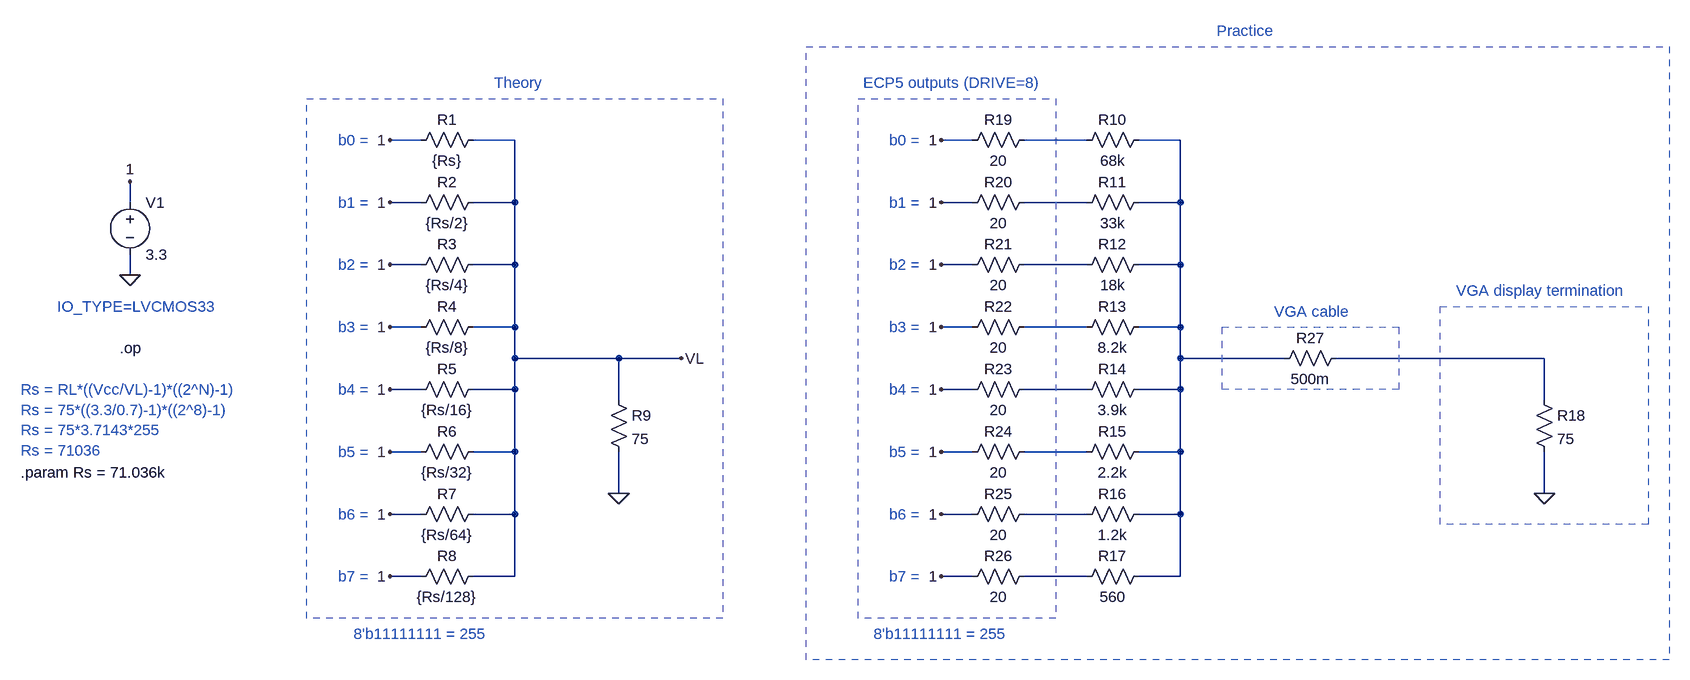
[diagram p0: schematic scon2019_badge_vga_ltspice.asc]
scon2019_badge_vga_ltspice.asc, the LTspice schematic file:
Version 4
SHEET 1 2388 804
WIRE 416 -80 368 -80
WIRE 560 -80 496 -80
WIRE 1264 -80 1216 -80
WIRE 1440 -80 1344 -80
WIRE 1584 -80 1520 -80
WIRE -32 16 -32 -16
WIRE 416 16 368 16
WIRE 560 16 560 -80
WIRE 560 16 496 16
WIRE 1264 16 1216 16
WIRE 1440 16 1344 16
WIRE 1584 16 1584 -80
WIRE 1584 16 1520 16
WIRE 416 112 368 112
WIRE 560 112 560 16
WIRE 560 112 496 112
WIRE 1264 112 1216 112
WIRE 1440 112 1344 112
WIRE 1584 112 1584 16
WIRE 1584 112 1520 112
WIRE -32 128 -32 96
WIRE 416 208 368 208
WIRE 560 208 560 112
WIRE 560 208 496 208
WIRE 1264 208 1216 208
WIRE 1440 208 1344 208
WIRE 1584 208 1584 112
WIRE 1584 208 1520 208
WIRE 560 256 560 208
WIRE 720 256 560 256
WIRE 816 256 720 256
WIRE 1584 256 1584 208
WIRE 1744 256 1584 256
WIRE 2144 256 1824 256
WIRE 416 304 368 304
WIRE 560 304 560 256
WIRE 560 304 496 304
WIRE 1264 304 1216 304
WIRE 1440 304 1344 304
WIRE 1584 304 1584 256
WIRE 1584 304 1520 304
WIRE 720 320 720 256
WIRE 2144 320 2144 256
WIRE 416 400 368 400
WIRE 560 400 560 304
WIRE 560 400 496 400
WIRE 1264 400 1216 400
WIRE 1440 400 1344 400
WIRE 1584 400 1584 304
WIRE 1584 400 1520 400
WIRE 720 464 720 400
WIRE 2144 464 2144 400
WIRE 416 496 368 496
WIRE 560 496 560 400
WIRE 560 496 496 496
WIRE 1264 496 1216 496
WIRE 1440 496 1344 496
WIRE 1584 496 1584 400
WIRE 1584 496 1520 496
WIRE 416 592 368 592
WIRE 560 592 560 496
WIRE 560 592 496 592
WIRE 1264 592 1216 592
WIRE 1440 592 1344 592
WIRE 1584 592 1584 496
WIRE 1584 592 1520 592
FLAG -32 128 0
FLAG -32 -16 1
FLAG 368 -80 1
FLAG 368 16 1
FLAG 368 112 1
FLAG 368 208 1
FLAG 368 304 1
FLAG 368 400 1
FLAG 368 496 1
FLAG 368 592 1
FLAG 720 464 0
FLAG 816 256 VL
FLAG 1216 -80 1
FLAG 1216 16 1
FLAG 1216 112 1
FLAG 1216 208 1
FLAG 1216 304 1
FLAG 1216 400 1
FLAG 1216 496 1
FLAG 1216 592 1
FLAG 2144 464 0
DATAFLAG 720 256 ""
DATAFLAG 2144 256 ""
SYMBOL voltage -32 0 R0
WINDOW 123 0 0 Left 0
WINDOW 39 0 0 Left 0
SYMATTR InstName V1
SYMATTR Value 3.3
SYMBOL res 512 -96 R90
WINDOW 0 0 56 VBottom 2
WINDOW 3 32 56 VTop 2
SYMATTR InstName R1
SYMATTR Value {Rs}
SYMBOL res 512 0 R90
WINDOW 0 0 56 VBottom 2
WINDOW 3 32 56 VTop 2
SYMATTR InstName R2
SYMATTR Value {Rs/2}
SYMBOL res 512 96 R90
WINDOW 0 0 56 VBottom 2
WINDOW 3 32 56 VTop 2
SYMATTR InstName R3
SYMATTR Value {Rs/4}
SYMBOL res 512 192 R90
WINDOW 0 0 56 VBottom 2
WINDOW 3 32 56 VTop 2
SYMATTR InstName R4
SYMATTR Value {Rs/8}
SYMBOL res 512 288 R90
WINDOW 0 0 56 VBottom 2
WINDOW 3 32 56 VTop 2
SYMATTR InstName R5
SYMATTR Value {Rs/16}
SYMBOL res 512 384 R90
WINDOW 0 0 56 VBottom 2
WINDOW 3 32 56 VTop 2
SYMATTR InstName R6
SYMATTR Value {Rs/32}
SYMBOL res 512 480 R90
WINDOW 0 0 56 VBottom 2
WINDOW 3 32 56 VTop 2
SYMATTR InstName R7
SYMATTR Value {Rs/64}
SYMBOL res 512 576 R90
WINDOW 0 0 56 VBottom 2
WINDOW 3 32 56 VTop 2
SYMATTR InstName R8
SYMATTR Value {Rs/128}
SYMBOL res 704 304 R0
SYMATTR InstName R9
SYMATTR Value 75
SYMBOL res 1536 -96 R90
WINDOW 0 0 56 VBottom 2
WINDOW 3 32 56 VTop 2
SYMATTR InstName R10
SYMATTR Value 68k
SYMBOL res 1536 0 R90
WINDOW 0 0 56 VBottom 2
WINDOW 3 32 56 VTop 2
SYMATTR InstName R11
SYMATTR Value 33k
SYMBOL res 1536 96 R90
WINDOW 0 0 56 VBottom 2
WINDOW 3 32 56 VTop 2
SYMATTR InstName R12
SYMATTR Value 18k
SYMBOL res 1536 192 R90
WINDOW 0 0 56 VBottom 2
WINDOW 3 32 56 VTop 2
SYMATTR InstName R13
SYMATTR Value 8.2k
SYMBOL res 1536 288 R90
WINDOW 0 0 56 VBottom 2
WINDOW 3 32 56 VTop 2
SYMATTR InstName R14
SYMATTR Value 3.9k
SYMBOL res 1536 384 R90
WINDOW 0 0 56 VBottom 2
WINDOW 3 32 56 VTop 2
SYMATTR InstName R15
SYMATTR Value 2.2k
SYMBOL res 1536 480 R90
WINDOW 0 0 56 VBottom 2
WINDOW 3 32 56 VTop 2
SYMATTR InstName R16
SYMATTR Value 1.2k
SYMBOL res 1536 576 R90
WINDOW 0 0 56 VBottom 2
WINDOW 3 32 56 VTop 2
SYMATTR InstName R17
SYMATTR Value 560
SYMBOL res 2128 304 R0
SYMATTR InstName R18
SYMATTR Value 75
SYMBOL res 1360 -96 R90
WINDOW 0 0 56 VBottom 2
WINDOW 3 32 56 VTop 2
SYMATTR InstName R19
SYMATTR Value 20
SYMBOL res 1360 0 R90
WINDOW 0 0 56 VBottom 2
WINDOW 3 32 56 VTop 2
SYMATTR InstName R20
SYMATTR Value 20
SYMBOL res 1360 96 R90
WINDOW 0 0 56 VBottom 2
WINDOW 3 32 56 VTop 2
SYMATTR InstName R21
SYMATTR Value 20
SYMBOL res 1360 192 R90
WINDOW 0 0 56 VBottom 2
WINDOW 3 32 56 VTop 2
SYMATTR InstName R22
SYMATTR Value 20
SYMBOL res 1360 288 R90
WINDOW 0 0 56 VBottom 2
WINDOW 3 32 56 VTop 2
SYMATTR InstName R23
SYMATTR Value 20
SYMBOL res 1360 384 R90
WINDOW 0 0 56 VBottom 2
WINDOW 3 32 56 VTop 2
SYMATTR InstName R24
SYMATTR Value 20
SYMBOL res 1360 480 R90
WINDOW 0 0 56 VBottom 2
WINDOW 3 32 56 VTop 2
SYMATTR InstName R25
SYMATTR Value 20
SYMBOL res 1360 576 R90
WINDOW 0 0 56 VBottom 2
WINDOW 3 32 56 VTop 2
SYMATTR InstName R26
SYMATTR Value 20
SYMBOL res 1840 240 R90
WINDOW 0 0 56 VBottom 2
WINDOW 3 32 56 VTop 2
SYMATTR InstName R27
SYMATTR Value 500m
TEXT -200 432 Left 2 !.param Rs = 71.036k
TEXT -48 240 Left 2 !.op
TEXT 288 -80 Left 2 ;b0 =
TEXT 288 16 Left 2 ;b1 =
TEXT 288 112 Left 2 ;b2 =
TEXT 288 208 Left 2 ;b3 =
TEXT 288 304 Left 2 ;b4 =
TEXT 288 400 Left 2 ;b5 =
TEXT 288 496 Left 2 ;b6 =
TEXT 288 592 Left 2 ;b7 =
TEXT -200 304 Left 2 ;Rs = RL*((Vcc/VL)-1)*((2^N)-1)\nRs = 75*((3.3/0.7)-1)*((2^8)-1)\nRs = 75*3.7143*255\nRs = 71036
TEXT 528 -168 Left 2 ;Theory
TEXT 1136 -80 Left 2 ;b0 =
TEXT 1136 16 Left 2 ;b1 =
TEXT 1136 112 Left 2 ;b2 =
TEXT 1136 208 Left 2 ;b3 =
TEXT 1136 304 Left 2 ;b4 =
TEXT 1136 400 Left 2 ;b5 =
TEXT 1136 496 Left 2 ;b6 =
TEXT 1136 592 Left 2 ;b7 =
TEXT 1640 -248 Left 2 ;Practice
TEXT 1096 -168 Left 2 ;ECP5 outputs (DRIVE=8)
TEXT 1728 184 Left 2 ;VGA cable
TEXT 2008 152 Left 2 ;VGA display termination
TEXT 312 680 Left 2 ;8'b11111111 = 255
TEXT 1112 680 Left 2 ;8'b11111111 = 255
TEXT -144 176 Left 2 ;IO_TYPE=LVCMOS33
RECTANGLE Normal 880 656 240 -144 2
RECTANGLE Normal 2336 720 1008 -224 2
RECTANGLE Normal 1392 656 1088 -144 2
RECTANGLE Normal 2304 512 1984 176 2
RECTANGLE Normal 1920 304 1648 208 2

The netlist it stands for:
* scon2019_badge_vga_ltspice.asc
V1 1 0 3.3
R1 VL 1 {Rs}
R2 VL 1 {Rs/2}
R3 VL 1 {Rs/4}
R4 VL 1 {Rs/8}
R5 VL 1 {Rs/16}
R6 VL 1 {Rs/32}
R7 VL 1 {Rs/64}
R8 VL 1 {Rs/128}
R9 VL 0 75
R10 N002 N001 68k
R11 N002 N003 33k
R12 N002 N004 18k
R13 N002 N005 8.2k
R14 N002 N007 3.9k
R15 N002 N008 2.2k
R16 N002 N009 1.2k
R17 N002 N010 560
R18 N006 0 75
R19 N001 1 20
R20 N003 1 20
R21 N004 1 20
R22 N005 1 20
R23 N007 1 20
R24 N008 1 20
R25 N009 1 20
R26 N010 1 20
R27 N006 N002 500m
.param Rs = 71.036k
.op
* b0 =
* b1 =
* b2 =
* b3 =
* b4 =
* b5 =
* b6 =
* b7 =
* Rs = RL*((Vcc/VL)-1)*((2^N)-1)
* Rs = 75*((3.3/0.7)-1)*((2^8)-1)
* Rs = 75*3.7143*255
* Rs = 71036
* Theory
* b0 =
* b1 =
* b2 =
* b3 =
* b4 =
* b5 =
* b6 =
* b7 =
* Practice
* ECP5 outputs (DRIVE=8)
* VGA cable
* VGA display termination
* 8'b11111111 = 255
* 8'b11111111 = 255
* IO_TYPE=LVCMOS33
.backanno
.end